# EAGLE schematic Cable (EAGLE 9.5.2)
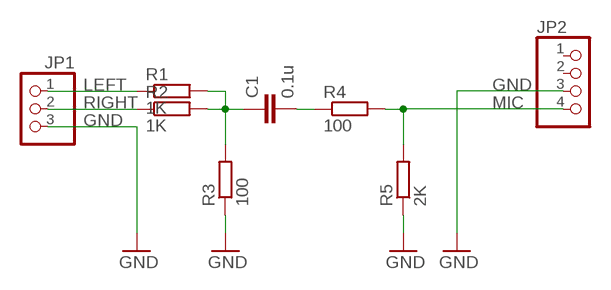
[diagram p0: schematic, sheet 1]

## Parts
C1  0.1u  C-EU025-025X050  [C025-025X050]
JP1  PINHD-1X3  [1X03]
JP2  PINHD-1X4  [1X04]
R1  1K  R-EU_0204/7  [0204/7]
R2  1K  R-EU_0204/7  [0204/7]
R3  100  R-EU_0204/5  [0204/5]
R4  100  R-EU_0204/5  [0204/5]
R5  2K  R-EU_0204/7  [0204/7]

## Nets
GND: JP1.3 JP2.3 R3.1 R5.1
LEFT: JP1.1 R1.1
MIC: JP2.4 R4.2 R5.2
N$1: C1.2 R4.1
N$4: C1.1 R1.2 R2.2 R3.2
RIGHT: JP1.2 R2.1
Unconnected: JP2.1 JP2.2

## Library data of the parts
C1 = rcl:C-EU: CAPACITOR, European symbol; SPICEPREFIX: C
JP1 = pinhead:PINHD-1X3: PIN HEADER
JP2 = pinhead:PINHD-1X4: PIN HEADER
R1-R5 = rcl:R-EU_: RESISTOR, European symbol; SPICEPREFIX: R